# Altium schematic sheet OBC_My_INTERFACE.SchDoc
size A2
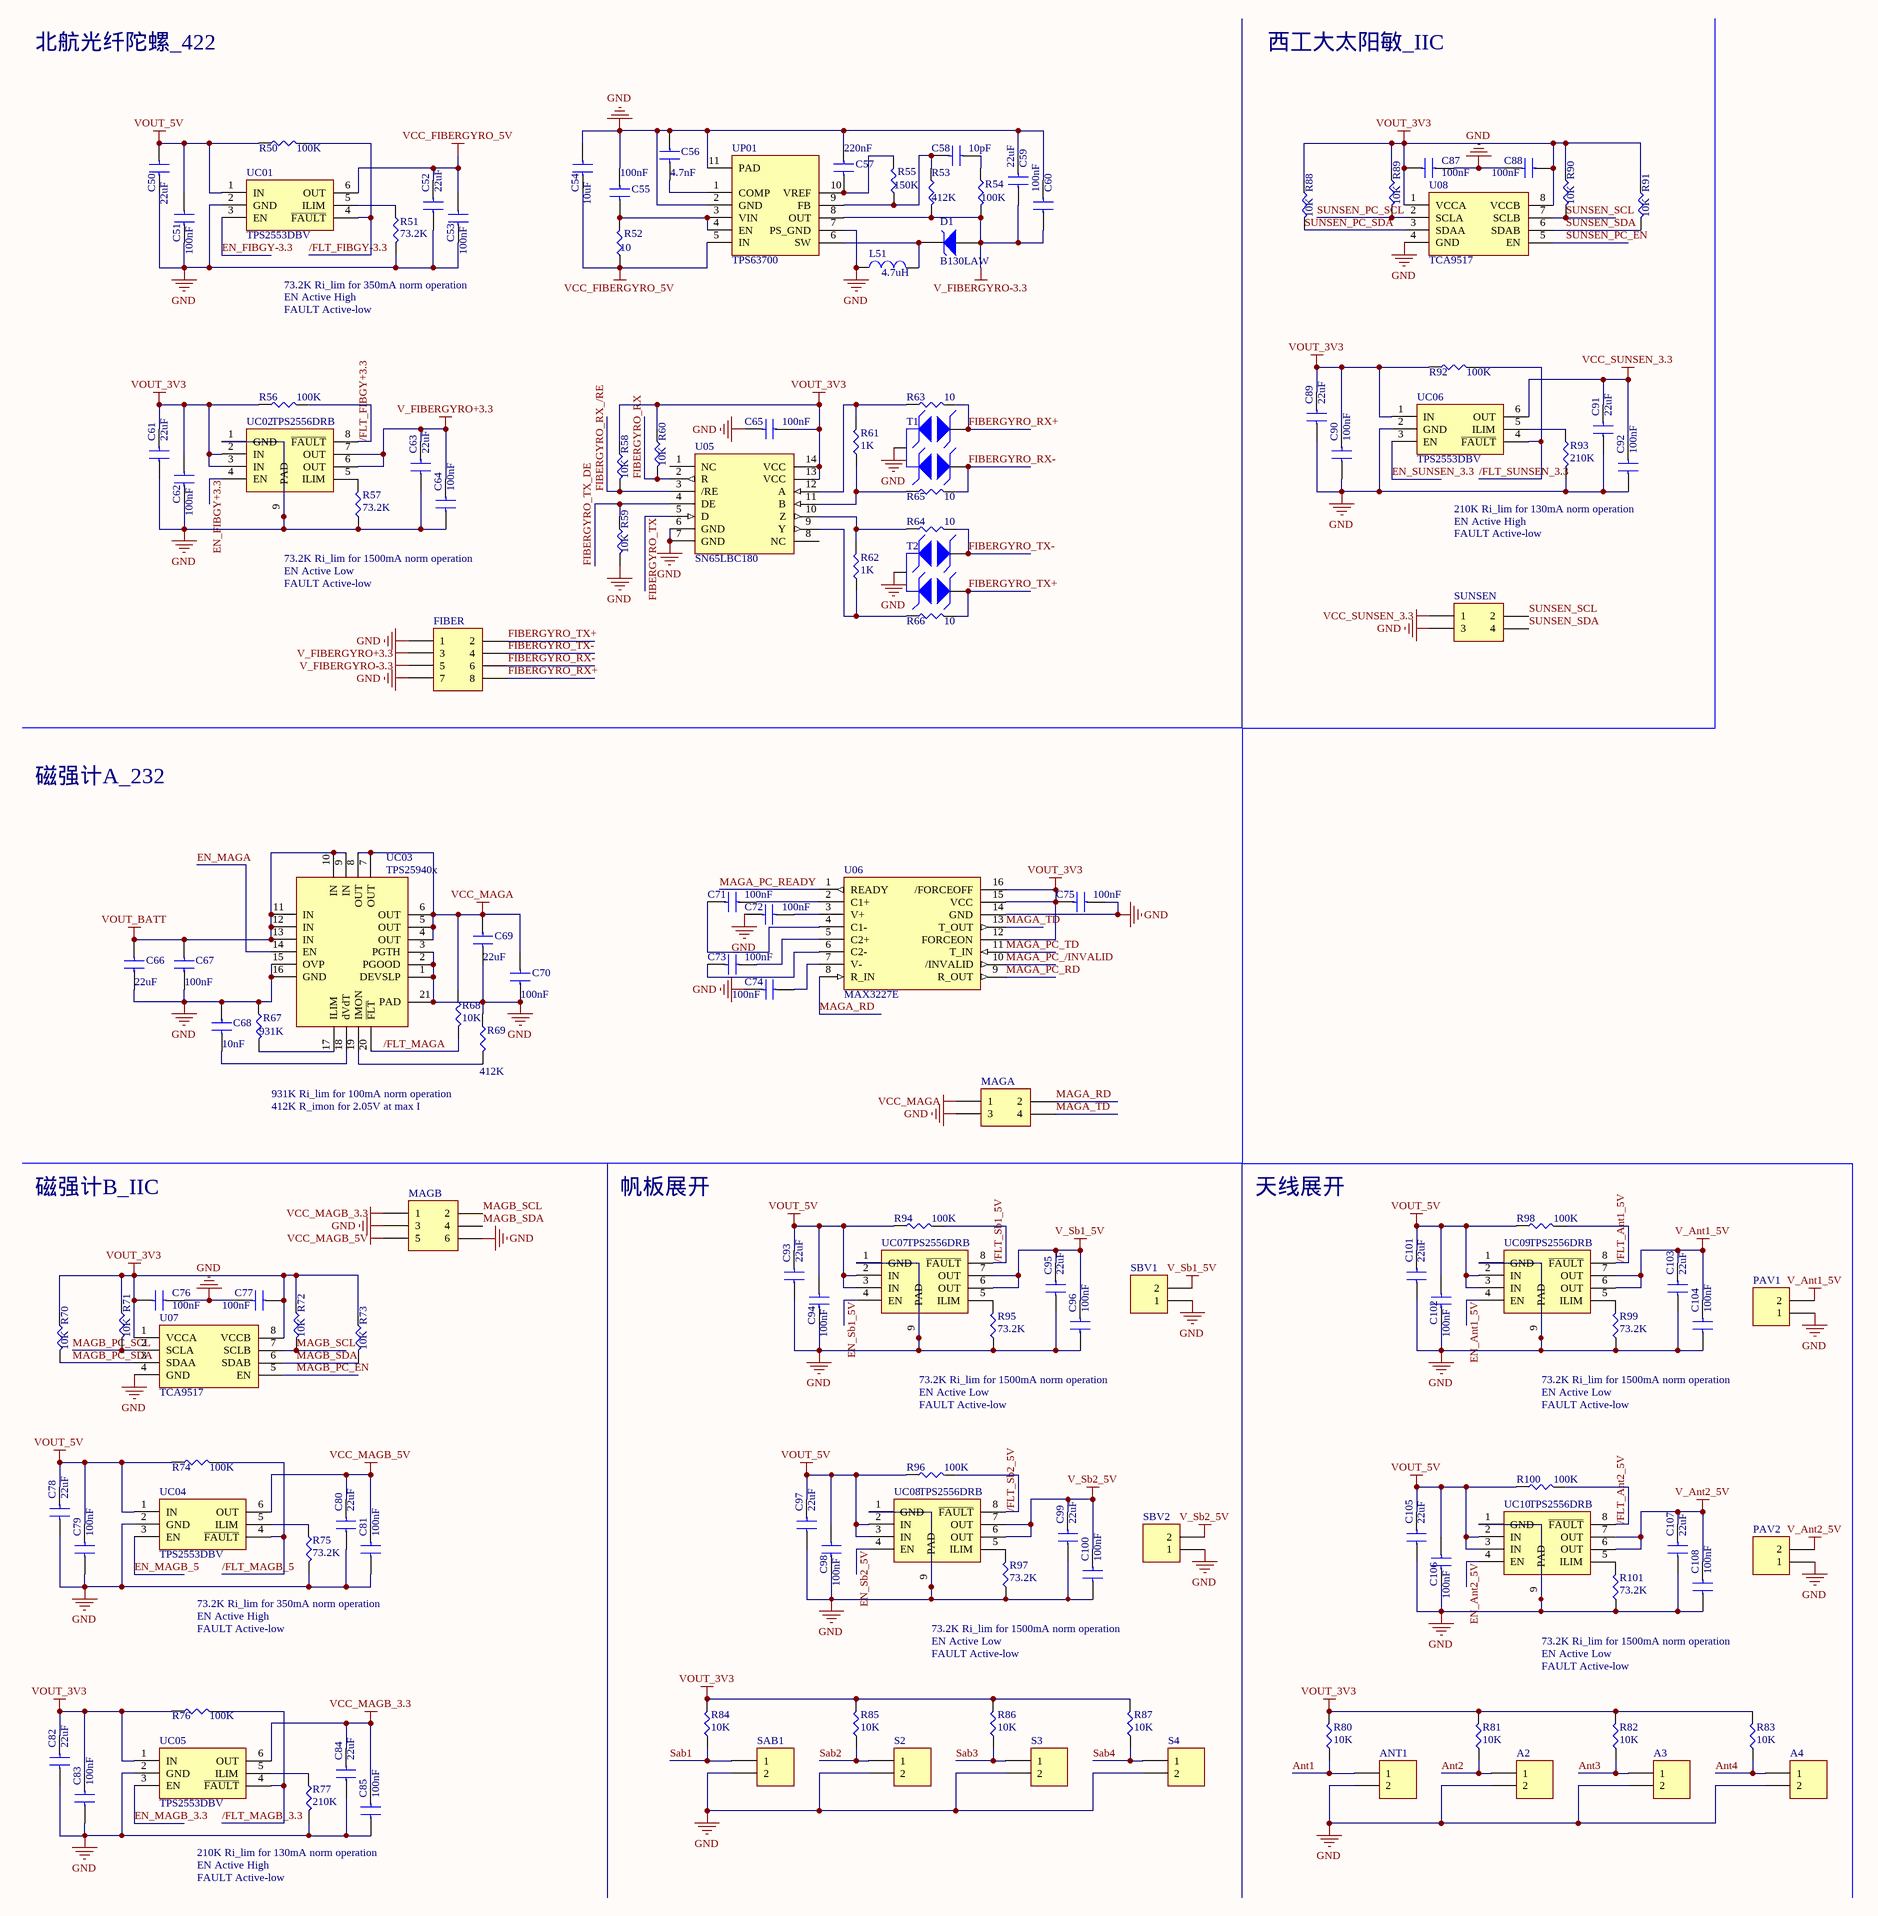
[diagram p0: OBC_My_INTERFACE.SchDoc]

## Parts
A2  Header 2  [HDR1X2]  (value not drawn)
A3  Header 2  [HDR1X2]  (value not drawn)
A4  Header 2  [HDR1X2]  (value not drawn)
ANT1  Header 2  [HDR1X2]  (value not drawn)
C50  22uF  [1210(3225)-C-IPC]
C51  100nF  [0805(2012)-C-IPC]
C52  22uF  [1210(3225)-C-IPC]
C53  100nF  [0805(2012)-C-IPC]
C54  10uF  [0805(2012)-C-IPC]
C55  100nF  [0603(1608)-C-IPC]
C56  4.7nF  [0603(1608)-C-IPC]
C57  220nF  [0603(1608)-C-IPC]
C58  10pF  [0603(1608)-C-IPC]
C59  22uF  [1210(3225)-C-IPC]
C60  100nF  [0805(2012)-C-IPC]
C61  22uF  [1210(3225)-C-IPC]
C62  100nF  [0805(2012)-C-IPC]
C63  22uF  [1210(3225)-C-IPC]
C64  100nF  [0805(2012)-C-IPC]
C65  100nF  [0603(1608)-C-IPC]
C66  22uF  [1210(3225)-C-IPC]
C67  100nF  [0805(2012)-C-IPC]
C68  10nF  [0603(1608)-C-IPC]
C69  22uF  [1210(3225)-C-IPC]
C70  100nF  [0805(2012)-C-IPC]
C71  100nF  [0603(1608)-C-IPC]
C72  100nF  [0603(1608)-C-IPC]
C73  100nF  [0603(1608)-C-IPC]
C74  100nF  [0603(1608)-C-IPC]
C75  100nF  [0603(1608)-C-IPC]
C76  100nF  [0603(1608)-C-IPC]
C77  100nF  [0603(1608)-C-IPC]
C78  22uF  [1210(3225)-C-IPC]
C79  100nF  [0805(2012)-C-IPC]
C80  22uF  [1210(3225)-C-IPC]
C81  100nF  [0805(2012)-C-IPC]
C82  22uF  [1210(3225)-C-IPC]
C83  100nF  [0805(2012)-C-IPC]
C84  22uF  [1210(3225)-C-IPC]
C85  100nF  [0805(2012)-C-IPC]
C87  100nF  [0603(1608)-C-IPC]
C88  100nF  [0603(1608)-C-IPC]
C89  22uF  [1210(3225)-C-IPC]
C90  100nF  [0805(2012)-C-IPC]
C91  22uF  [1210(3225)-C-IPC]
C92  100nF  [0805(2012)-C-IPC]
C93  22uF  [1210(3225)-C-IPC]
C94  100nF  [0805(2012)-C-IPC]
C95  22uF  [1210(3225)-C-IPC]
C96  100nF  [0805(2012)-C-IPC]
C97  22uF  [1210(3225)-C-IPC]
C98  100nF  [0805(2012)-C-IPC]
C99  22uF  [1210(3225)-C-IPC]
C100  100nF  [0805(2012)-C-IPC]
C101  22uF  [1210(3225)-C-IPC]
C102  100nF  [0805(2012)-C-IPC]
C103  22uF  [1210(3225)-C-IPC]
C104  100nF  [0805(2012)-C-IPC]
C105  22uF  [1210(3225)-C-IPC]
C106  100nF  [0805(2012)-C-IPC]
C107  22uF  [1210(3225)-C-IPC]
C108  100nF  [0805(2012)-C-IPC]
D1  B130LAW  [SOD-123-D-IPC]
FIBER  Header 4X2  [HDR2X4]  (value not drawn)
L51  value 4.7uH  [Inductor-CoilCraft-XAL40xx]  (hidden comment: XAL4030-472)
MAGA  Header 2X2  [HDR2X2]  (value not drawn)
MAGB  Header 3X2  [HDR2X3]  (value not drawn)
PAV1  Header 2  [HDR1X2]  (value not drawn)
PAV2  Header 2  [HDR1X2]  (value not drawn)
R50  100K  [0603(1608)-R-IPC]
R51  73.2K  [0603(1608)-R-IPC]
R52  10  [0603(1608)-R-IPC]
R53  412K  [0603(1608)-R-IPC]
R54  100K  [0603(1608)-R-IPC]
R55  150K  [0603(1608)-R-IPC]
R56  100K  [0603(1608)-R-IPC]
R57  73.2K  [0603(1608)-R-IPC]
R58  10K  [0603(1608)-R-IPC]
R59  10K  [0603(1608)-R-IPC]
R60  10K  [0603(1608)-R-IPC]
R61  value 1K  [0603(1608)-R-IPC]  (hidden comment: Rt)
R62  value 1K  [0603(1608)-R-IPC]  (hidden comment: Rt)
R63  10  [0603(1608)-R-IPC]
R64  10  [0603(1608)-R-IPC]
R65  10  [0603(1608)-R-IPC]
R66  10  [0603(1608)-R-IPC]
R67  931K  [0603(1608)-R-IPC]
R68  10K  [0603(1608)-R-IPC]
R69  412K  [0603(1608)-R-IPC]
R70  10K  [0603(1608)-R-IPC]
R71  10K  [0603(1608)-R-IPC]
R72  10K  [0603(1608)-R-IPC]
R73  10K  [0603(1608)-R-IPC]
R74  100K  [0603(1608)-R-IPC]
R75  73.2K  [0603(1608)-R-IPC]
R76  100K  [0603(1608)-R-IPC]
R77  210K  [0603(1608)-R-IPC]
R80  10K  [0603(1608)-R-IPC]
R81  10K  [0603(1608)-R-IPC]
R82  10K  [0603(1608)-R-IPC]
R83  10K  [0603(1608)-R-IPC]
R84  10K  [0603(1608)-R-IPC]
R85  10K  [0603(1608)-R-IPC]
R86  10K  [0603(1608)-R-IPC]
R87  10K  [0603(1608)-R-IPC]
R88  10K  [0603(1608)-R-IPC]
R89  10K  [0603(1608)-R-IPC]
R90  10K  [0603(1608)-R-IPC]
R91  10K  [0603(1608)-R-IPC]
R92  100K  [0603(1608)-R-IPC]
R93  210K  [0603(1608)-R-IPC]
R94  100K  [0603(1608)-R-IPC]
R95  73.2K  [0603(1608)-R-IPC]
R96  100K  [0603(1608)-R-IPC]
R97  73.2K  [0603(1608)-R-IPC]
R98  100K  [0603(1608)-R-IPC]
R99  73.2K  [0603(1608)-R-IPC]
R100  100K  [0603(1608)-R-IPC]
R101  73.2K  [0603(1608)-R-IPC]
S2  Header 2  [HDR1X2]  (value not drawn)
S3  Header 2  [HDR1X2]  (value not drawn)
S4  Header 2  [HDR1X2]  (value not drawn)
SAB1  Header 2  [HDR1X2]  (value not drawn)
SBV1  Header 2  [HDR1X2]  (value not drawn)
SBV2  Header 2  [HDR1X2]  (value not drawn)
SUNSEN  Header 2X2  [HDR2X2]  (value not drawn)
T1  TVS-0502B  [SOT23-3]  (value not drawn)
T2  TVS-0502B  [SOT23-3]  (value not drawn)
U05  SN65LBC180  [SOIC127P600X175-14N]
U06  MAX3227E  [SSOP-16_208mil]
U07  TCA9517  [TSSOP-8-3x3-IPC]
U08  TCA9517  [TSSOP-8-3x3-IPC]
UC01  TPS2553DBV  [SOT23-6-IPC]
UC02  TPS2556DRB  [SON-8-3x3-w.TP-IPC]
UC03  TPS25940x  [QFN-20-0.5-3x4-w.TP-IPC]
UC04  TPS2553DBV  [SOT23-6-IPC]
UC05  TPS2553DBV  [SOT23-6-IPC]
UC06  TPS2553DBV  [SOT23-6-IPC]
UC07  TPS2556DRB  [SON-8-3x3-w.TP-IPC]
UC08  TPS2556DRB  [SON-8-3x3-w.TP-IPC]
UC09  TPS2556DRB  [SON-8-3x3-w.TP-IPC]
UC10  TPS2556DRB  [SON-8-3x3-w.TP-IPC]
UP01  TPS63700  [DFN-10-0.5-3x3-w.TP-IPC]

## Nets
GND: A2.2 A3.2 A4.2 ANT1.2 C50.2 C51.2 C52.2 C53.2 C54.1 C55.2 C56.2 C57.2 C59.1 C60.1 C61.2 C62.2 C63.2 C64.2 C65.2 C66.2 C67.2 C68.2 C69.2 C70.2 C72.1 C74.2 C75.1 C76.2 C77.2 C78.2 C79.2 C80.2 C81.2 C82.2 C83.2 C84.2 C85.2 C87.2 C88.2 C89.2 C90.2 C91.2 C92.2 C93.2 C94.2 C95.2 C96.2 C97.2 C98.2 C99.2 C100.2 C101.2 C102.2 C103.2 C104.2 C105.2 C106.2 C107.2 C108.2 FIBER.1 FIBER.7 L51.1 MAGA.3 MAGB.3 MAGB.6 PAV1.1 PAV2.1 R51.2 R57.1 R59.2 R67.1 R69.1 R75.2 R77.2 R93.2 R95.1 R97.1 R99.1 R101.1 S2.2 S3.2 S4.2 SAB1.2 SBV1.1 SBV2.1 SUNSEN.3 T1.3 T2.3 U05.6(GND) U05.7(GND) U06.14(GND) U07.4(GND) U08.4(GND) UC01.2(GND) UC02.1(GND) UC02.9(PAD) UC03.1(DEVSLP) UC03.2(PGOOD) UC03.3(PGTH) UC03.15(OVP) UC03.16(GND) UC03.21(PAD) UC04.2(GND) UC05.2(GND) UC06.2(GND) UC07.1(GND) UC07.9(PAD) UC08.1(GND) UC08.9(PAD) UC09.1(GND) UC09.9(PAD) UC10.1(GND) UC10.9(PAD) UP01.2(GND) UP01.7(PS_GND) UP01.11(PAD)
V_Ant1_5V: C103.1 C104.1 PAV1.2 UC09.6(OUT) UC09.7(OUT)
V_Ant2_5V: C107.1 C108.1 PAV2.2 UC10.6(OUT) UC10.7(OUT)
V_FIBERGYRO+3.3: C63.1 C64.1 FIBER.3 UC02.6(OUT) UC02.7(OUT)
V_FIBERGYRO-3.3: C59.2 C60.2 D1.1(A) FIBER.5 R53.2 R54.2 UP01.8(OUT)
V_Sb1_5V: C95.1 C96.1 SBV1.2 UC07.6(OUT) UC07.7(OUT)
V_Sb2_5V: C99.1 C100.1 SBV2.2 UC08.6(OUT) UC08.7(OUT)
VCC_FIBERGYRO_5V: C52.1 C53.1 C54.2 R52.1 UC01.6(OUT) UP01.5(IN)
VCC_MAGA: C69.1 C70.1 MAGA.1 R68.1 UC03.4(OUT) UC03.5(OUT) UC03.6(OUT) UC03.7(OUT) UC03.8(OUT)
VCC_MAGB_3.3: C84.1 C85.1 MAGB.1 UC05.6(OUT)
VCC_MAGB_5V: C80.1 C81.1 MAGB.5 UC04.6(OUT)
VCC_SUNSEN_3.3: C91.1 C92.1 SUNSEN.1 UC06.6(OUT)
VOUT_3V3: C61.1 C62.1 C65.1 C75.2 C76.1 C77.1 C82.1 C83.1 C87.1 C88.1 C89.1 C90.1 R56.1 R58.1 R60.1 R70.1 R71.1 R72.1 R73.1 R76.1 R80.2 R81.2 R82.2 R83.2 R84.2 R85.2 R86.2 R87.2 R88.1 R89.1 R90.1 R91.1 R92.1 U05.13(VCC) U05.14(VCC) U06.12(FORCEON) U06.15(VCC) U06.16(/FORCEOFF) U07.1(VCCA) U07.8(VCCB) U08.1(VCCA) U08.8(VCCB) UC02.2(IN) UC02.3(IN) UC05.1(IN) UC06.1(IN)
VOUT_5V: C50.1 C51.1 C78.1 C79.1 C93.1 C94.1 C97.1 C98.1 C101.1 C102.1 C105.1 C106.1 R50.1 R74.1 R94.1 R96.1 R98.1 R100.1 UC01.1(IN) UC04.1(IN) UC07.2(IN) UC07.3(IN) UC08.2(IN) UC08.3(IN) UC09.2(IN) UC09.3(IN) UC10.2(IN) UC10.3(IN)
VOUT_BATT: C66.1 C67.1 UC03.9(IN) UC03.10(IN) UC03.11(IN) UC03.12(IN) UC03.13(IN)
/FLT_Ant1_5V: R98.2 UC09.8(~{FAULT})
/FLT_Ant2_5V: R100.2 UC10.8(~{FAULT})
/FLT_FIBGY+3.3: R56.2 UC02.8(~{FAULT})
/FLT_FIBGY-3.3: R50.2 UC01.4(~{FAULT})
/FLT_MAGA: R68.2 UC03.20(~{FLT})
/FLT_MAGB_3.3: R76.2 UC05.4(~{FAULT})
/FLT_MAGB_5: R74.2 UC04.4(~{FAULT})
/FLT_Sb1_5V: R94.2 UC07.8(~{FAULT})
/FLT_Sb2_5V: R96.2 UC08.8(~{FAULT})
/FLT_SUNSEN_3.3: R92.2 UC06.4(~{FAULT})
Ant1: ANT1.1 R80.1
Ant2: A2.1 R81.1
Ant3: A3.1 R82.1
Ant4: A4.1 R83.1
EN_Ant1_5V: UC09.4(EN)
EN_Ant2_5V: UC10.4(EN)
EN_FIBGY+3.3: UC02.4(EN)
EN_FIBGY-3.3: UC01.3(EN)
EN_MAGA: UC03.14(EN)
EN_MAGB_3.3: UC05.3(EN)
EN_MAGB_5: UC04.3(EN)
EN_Sb1_5V: UC07.4(EN)
EN_Sb2_5V: UC08.4(EN)
EN_SUNSEN_3.3: UC06.3(EN)
FIBERGYRO_RX: R60.2 U05.2(R)
FIBERGYRO_RX+: FIBER.8 R63.2 T1.2
FIBERGYRO_RX-: FIBER.6 R65.2 T1.1
FIBERGYRO_RX_/RE: R58.2 U05.3(/RE)
FIBERGYRO_TX: U05.5(D)
FIBERGYRO_TX+: FIBER.2 R66.2 T2.1
FIBERGYRO_TX-: FIBER.4 R64.2 T2.2
FIBERGYRO_TX_DE: R59.1 U05.4(DE)
MAGA_PC_/INVALID: U06.10(/INVALID)
MAGA_PC_RD: U06.9(R_OUT)
MAGA_PC_READY: U06.1(READY)
MAGA_PC_TD: U06.11(T_IN)
MAGA_RD: MAGA.2 U06.8(R_IN)
MAGA_TD: MAGA.4 U06.13(T_OUT)
MAGB_PC_EN: U07.5(EN)
MAGB_PC_SCL: R71.2 U07.2(SCLA)
MAGB_PC_SDA: R70.2 U07.3(SDAA)
MAGB_SCL: MAGB.2 R72.2 U07.7(SCLB)
MAGB_SDA: MAGB.4 R73.2 U07.6(SDAB)
Sab1: R84.1 SAB1.1
Sab2: R85.1 S2.1
Sab3: R86.1 S3.1
Sab4: R87.1 S4.1
SUNSEN_PC_EN: U08.5(EN)
SUNSEN_PC_SCL: R89.2 U08.2(SCLA)
SUNSEN_PC_SDA: R88.2 U08.3(SDAA)
SUNSEN_SCL: R90.2 SUNSEN.2 U08.7(SCLB)
SUNSEN_SDA: R91.2 SUNSEN.4 U08.6(SDAB)
NetC55_1: C55.1 R52.2 UP01.3(VIN) UP01.4(EN)
NetC56_1: C56.1 UP01.1(COMP)
NetC57_1: C57.1 R55.2 UP01.10(VREF)
NetC58_1: C58.1 R54.1
NetC58_2: C58.2 R53.1 R55.1 UP01.9(FB)
NetC68_1: C68.1 UC03.18(dVdT)
NetC71_1: C71.1 U06.2(C1+)
NetC71_2: C71.2 U06.4(C1-)
NetC72_2: C72.2 U06.3(V+)
NetC73_1: C73.1 U06.5(C2+)
NetC73_2: C73.2 U06.6(C2-)
NetC74_1: C74.1 U06.7(V-)
NetD1_2: D1.2(K) L51.2 UP01.6(SW)
NetR51_1: R51.1 UC01.5(ILIM)
NetR57_2: R57.2 UC02.5(ILIM)
NetR61_1: R61.1 R65.1 U05.11(B)
NetR61_2: R61.2 R63.1 U05.12(A)
NetR62_1: R62.1 R66.1 U05.9(Y)
NetR62_2: R62.2 R64.1 U05.10(Z)
NetR67_2: R67.2 UC03.17(ILIM)
NetR69_2: R69.2 UC03.19(IMON)
NetR75_1: R75.1 UC04.5(ILIM)
NetR77_1: R77.1 UC05.5(ILIM)
NetR93_1: R93.1 UC06.5(ILIM)
NetR95_2: R95.2 UC07.5(ILIM)
NetR97_2: R97.2 UC08.5(ILIM)
NetR99_2: R99.2 UC09.5(ILIM)
NetR101_2: R101.2 UC10.5(ILIM)

Not connected (* = marked no-connect by the designer): U05 1(NC) 8(NC)

## Notes on the sheet
- 北航光纤陀螺_422
- 西工大太阳敏_IIC
- 73.2K Ri_lim for 350mA norm operation
- EN Active High
- FAULT Active-low
- 210K Ri_lim for 130mA norm operation
- 73.2K Ri_lim for 1500mA norm operation
- EN Active Low
- 磁强计A_232
- 931K Ri_lim for 100mA norm operation
- 412K R_imon for 2.05V at max I
- 磁强计B_IIC
- 帆板展开
- 天线展开

## Library data of the parts
A2-A4 ANT1 PAV1 PAV2 S2-S4 SAB1 SBV1 SBV2 = Header 2: Header, 2-Pin; LatestRevisionDate: 17-Jul-2002; LatestRevisionNote: Re-released for DXP Platform.; Publisher: Altium Limited
C50-C85 C87-C108 = Cap_1: Nonpolarized Capacitor (Surface Mount)
  C50 C52 C59 C61 C63 C66 C69 C78 C80 C82 C84 C89 C91 C93 C95 C97 C99 C101 C103 C105 C107: Value: 22uF
  C51 C53 C55 C60 C62 C64 C65 C67 C70-C77 C79 C81 C83 C85 C87 C88 C90 C92 C94 C96 C98 C100 C102 C104 C106 C108: Value: 100nF
  C54: Value: 10uF
  C56: Value: 4.7nF
  C57: Value: 220nF
  C58: Value: 10pF
  C68: Value: 10nF
D1 = D Schottky: Schottky Diode
FIBER = Header 4X2: Header, 4-Pin, Dual row; LatestRevisionDate: 17-Jul-2002; LatestRevisionNote: Re-released for DXP Platform.; Publisher: Altium Limited
L51 = Inductor_1: Inductor
MAGA SUNSEN = Header 2X2: Header, 2-Pin, Dual row; LatestRevisionDate: 17-Jul-2002; LatestRevisionNote: Re-released for DXP Platform.; Publisher: Altium Limited
MAGB = Header 3X2: Header, 3-Pin, Dual row; LatestRevisionDate: 17-Jul-2002; LatestRevisionNote: Re-released for DXP Platform.; Publisher: Altium Limited
R50-R77 R80-R101 = Res_1: Resistor
  R50 R54 R56 R74 R76 R92 R94 R96 R98 R100: Value: 100K
  R51 R57 R75 R95 R97 R99 R101: Value: 73.2K
  R52 R63-R66: Value: 10
  R53 R69: Value: 412K
  R55: Value: 150K
  R58-R60 R68 R70-R73 R80-R91: Value: 10K
  R67: Value: 931K
  R77 R93: Value: 210K
T1 T2 = TVS-0502B: ESD Protection Array
U05 = SN65HVD76: 3.3-V 422/485 Transceivers
U06 = MAX3227E: RS-232 Transceiver
U07 U08 = TCA9517: I2C A-side drivers and B-side drivers
UC01 UC04 UC05 UC06 = TPS2553DBV: PRECISION ADJUSTABLE CURRENT-LIMITED POWER-DISTRIBUTION SWITCHES
UC02 UC07 UC08 UC09 UC10 = TPS2556DRB: PRECISION ADJUSTABLE CURRENT-LIMITED POWER-DISTRIBUTION SWITCHES
UC03 = TPS25940x: 18V eFuse with True Reverse Blocking and DevSleep Support for SSDs
UP01 = TPS63700: DC-DC Inverter